# EAGLE design CyloRen-v.6.0 (EAGLE 9.1.0)
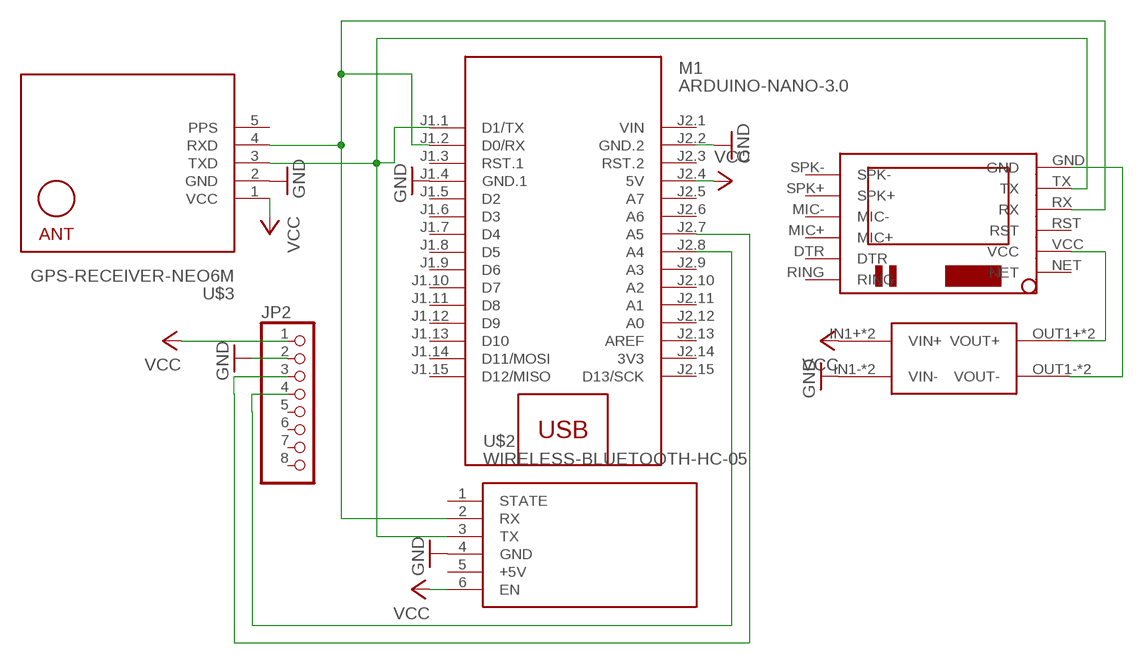
[diagram p0: schematic, sheet 1]

## Parts
JP2  PINHD-1X8BIG  [1X08-BIG]
M1  ARDUINO-NANO-3.0  [ARDUINO-NANO-3.0]
U$1  MP1584  [DC-BRICK]
U$2  WIRELESS-BLUETOOTH-HC-05  [WIRELESS-BLUETOOTH-HC-05]
U$3  GPS-RECEIVER-NEO6M  [GPS-RECEIVER-NEO6M]
U$4  SIM800LMODULE  [SIM800LMODULE]

## Nets
GND: JP2.2 M1.J1.4(GND.1) M1.J2.2(GND.2) U$1.IN1-(VIN-) U$1.IN2-(VIN-) U$2.4(GND) U$3.2(GND)
N$1: JP2.3 M1.J2.7(A5)
N$3: JP2.4 M1.J2.8(A4)
N$6: U$1.OUT1+(VOUT+) U$1.OUT2+(VOUT+) U$4.VCC
N$7: M1.J1.1(D1/TX) U$2.3(TX) U$3.3(TXD) U$4.TX
N$8: M1.J1.2(D0/RX) U$2.2(RX) U$3.4(RXD) U$4.RX
N$9: U$1.OUT1-(VOUT-) U$1.OUT2-(VOUT-) U$4.GND
VCC: JP2.1 M1.J2.4(5V) U$1.IN1+(VIN+) U$1.IN2+(VIN+) U$2.6(EN) U$3.1(VCC)
Unconnected: JP2.5 JP2.6 JP2.7 JP2.8 M1.J1.3(RST.1) M1.J1.5(D2) M1.J1.6(D3) M1.J1.7(D4) M1.J1.8(D5) M1.J1.9(D6) M1.J1.10(D7) M1.J1.11(D8) M1.J1.12(D9) M1.J1.13(D10) M1.J1.14(D11/MOSI) M1.J1.15(D12/MISO) M1.J2.3(RST.2) M1.J2.5(A7) M1.J2.6(A6) M1.J2.9(A3) M1.J2.10(A2) M1.J2.11(A1) M1.J2.12(A0) M1.J2.13(AREF) M1.J2.15(D13/SCK) U$2.1(STATE) U$4.DTR U$4.MIC+ U$4.MIC- U$4.NET U$4.RING U$4.RST U$4.SPK+ U$4.SPK-

## Power pins joined to a net without a drawn wire
3V3: M1.J2.14(3V3)
+5V: U$2.5(+5V)
PPS: U$3.5(PPS)
VIN: M1.J2.1(VIN)

## Library data of the parts
JP2 = adafruit:PINHD-1X8: PIN HEADER
M1 = diy-modules:ARDUINO-NANO-3.0: Arduino Nano 3.0 and compatible devices More details available here: https://www.arduino.cc/en/Main/ArduinoBoardNano Click here to find device on ebay.com <http://www.ebay.com/sch/arduino+nano>
U$1 = MP1584-dc-brick:MP1584: MP1584-dc-brick-pcb Step down Input: 4.5V - 28V Ouput 0.8V - 25V max. 3A Cheap on ebay
U$2 = diy-modules:WIRELESS-BLUETOOTH-HC-05: Bluetooth Transceiver Module based on HC-05 board Tutorial is available here: https://arduino-info.wikispaces.com/BlueTooth-HC05-HC06-Modules-How-To Click here to find device on ebay.com <http://www.ebay.com/sch/hc-05+module+rs232>
U$3 = diy-modules:GPS-RECEIVER-NEO6M: GPS Receiver Module based on NEO-6 device Short tutorial how to use NEO-6 module with Arduino: http://www.xarg.org/2016/06/neo6mv2-gps-module-with-arduino/ NEO-6 datasheet is available here: https://www.u-blox.com/sites/default/files/products/documents/NEO-6_DataSheet_%28GPS.G6-HW-09005%29.pdf Click here to find device on ebay.com <http://www.ebay.com/sch/gyneo6mv2>
U$4 = SIM800LMODULE:SIM800LMODULE: SIM800L Module

## Board
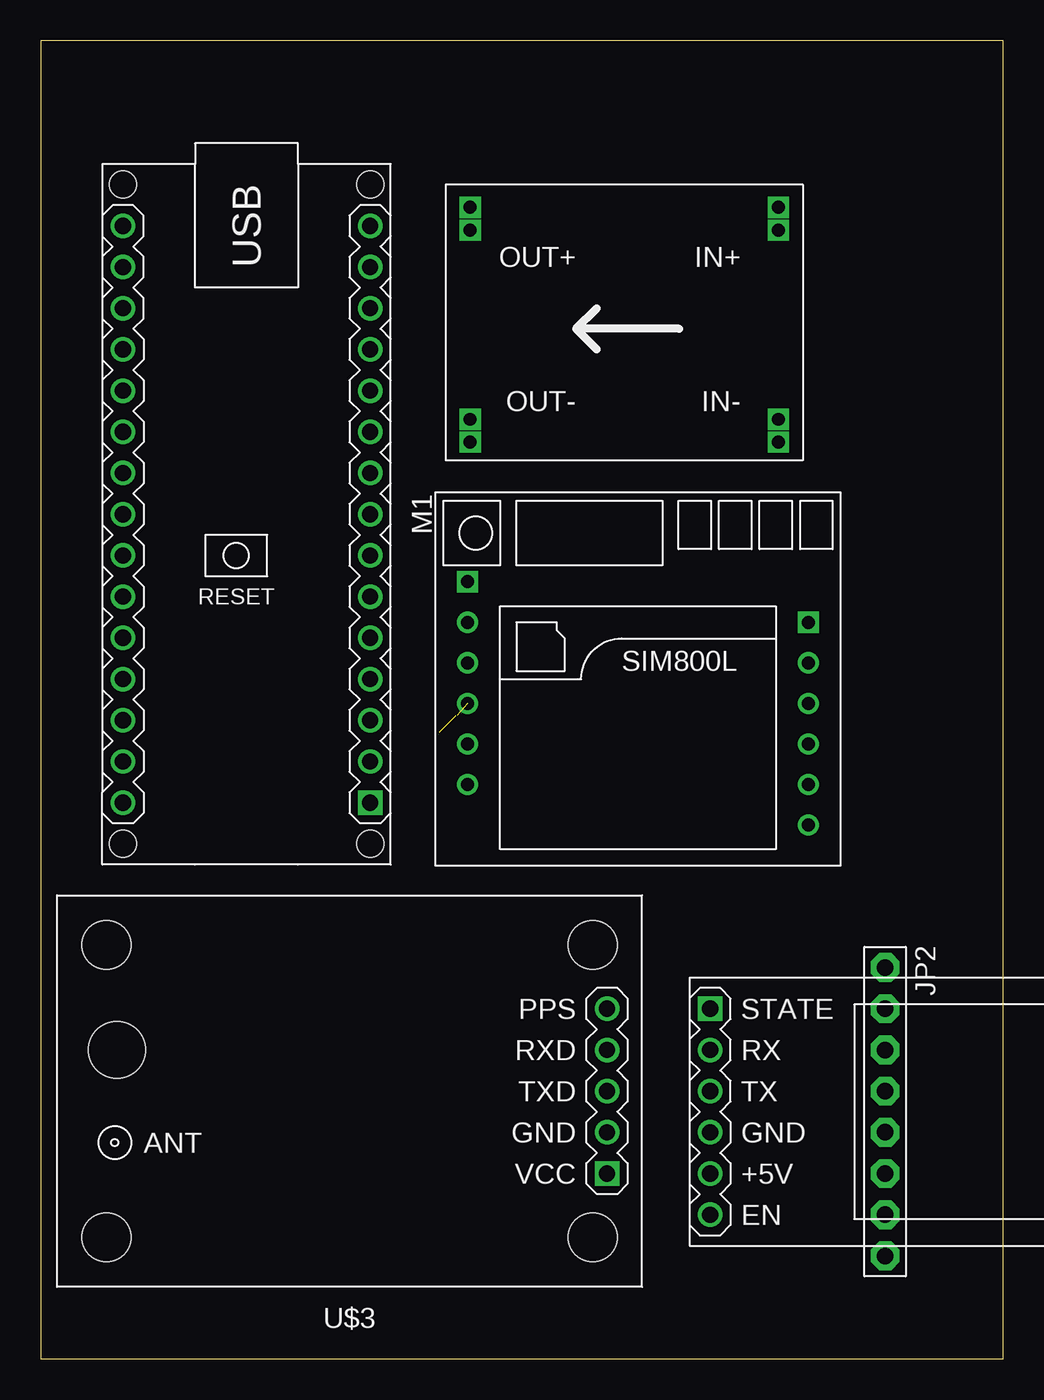
[diagram p1: board, top side]
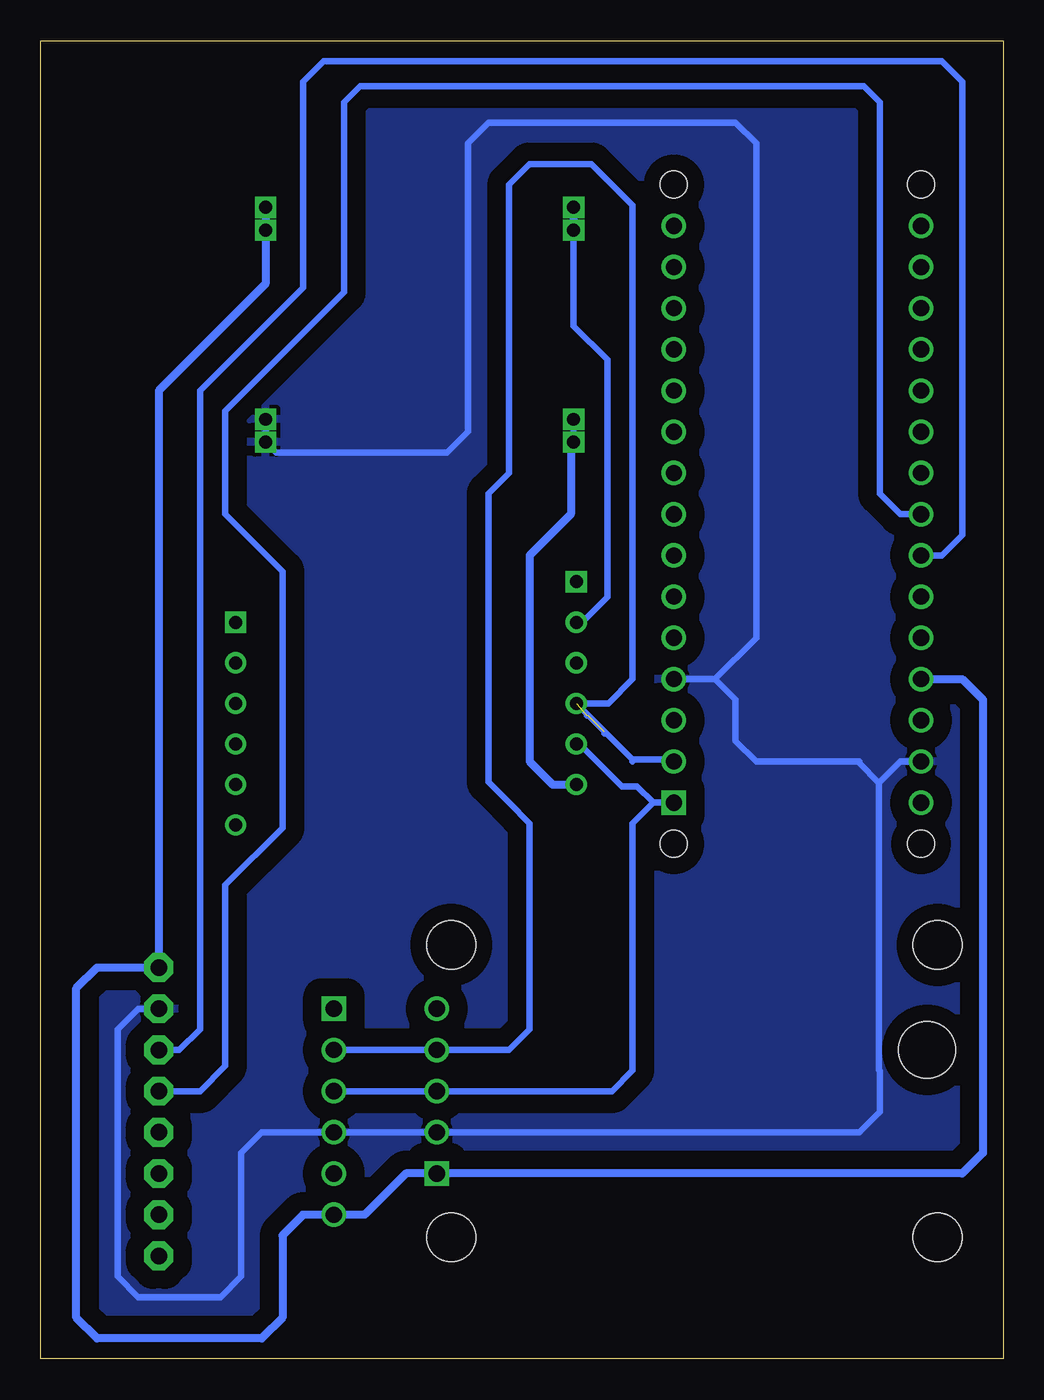
[diagram p2: board, bottom side, seen from below]

Size 59.36 x 81.27 mm. Coordinates in mm from the lower left corner, seen from the top.
Outline: 0,0 59.36,0 59.36,81.27 0,81.27 0,0
Copper layers (1*16): Top 0.035mm / dielectric 1.5mm / Bottom 0.035mm
Design rules "default *": minimum track width 6mil, minimum drill 0.35mm, track to track 45mil, track to pad 35mil, pad to pad 6mil, via to via 6mil, smd to smd 6mil, copper to edge 40mil, drill to drill 6mil, minimum pad ring 10mil, minimum via ring 8mil, stop-mask expansion 4mil, vias tented up to drill 0mil, thermal gap 10mil

### Footprints (pad centres in the part's own frame; a part is rotated, then mirrored left to right if it is on the bottom)
1X08-BIG = drill 1.016 pad 1.778 octagon: 1 -8.89,0; 2 -6.35,0; 3 -3.81,0; 4 -1.27,0; 5 1.27,0; 6 3.81,0; 7 6.35,0; 8 8.89,0
ARDUINO-NANO-3.0 = drill 1 square: J1.1 17.78,7.62 | drill 1: J1.2 15.24,7.62; J1.3 12.7,7.62; J1.4 10.16,7.62; J1.5 7.62,7.62; J1.6 5.08,7.62; J1.7 2.54,7.62; J1.8 0,7.62; J1.9 -2.54,7.62; J1.10 -5.08,7.62; J1.11 -7.62,7.62; J1.12 -10.16,7.62; J1.13 -12.7,7.62; J1.14 -15.24,7.62; J1.15 -17.78,7.62; J2.1 17.78,-7.62; J2.2 15.24,-7.62; J2.3 12.7,-7.62; J2.4 10.16,-7.62; J2.5 7.62,-7.62; J2.6 5.08,-7.62; J2.7 2.54,-7.62; J2.8 0,-7.62; J2.9 -2.54,-7.62; J2.10 -5.08,-7.62; J2.11 -7.62,-7.62; J2.12 -10.16,-7.62; J2.13 -12.7,-7.62; J2.14 -15.24,-7.62; J2.15 -17.78,-7.62 | hole 1.651: -20.32,7.62; -20.32,-7.62; 20.32,-7.62; 20.32,7.62
DC-BRICK = drill 0.8 square: IN1+ 1.5,1.4; IN1- 1.5,14.47; IN2+ 1.5,2.8; IN2- 1.5,15.87; OUT1+ 20.5,1.4; OUT1- 20.5,14.47; OUT2+ 20.5,2.8; OUT2- 20.5,15.87
WIRELESS-BLUETOOTH-HC-05 = drill 1 square: 1 -6.35,-17.145 | drill 1: 2 -3.81,-17.145; 3 -1.27,-17.145; 4 1.27,-17.145; 5 3.81,-17.145; 6 6.35,-17.145
GPS-RECEIVER-NEO6M = drill 1 square: 1 -15.875,5.08 | drill 1: 2 -15.875,2.54; 3 -15.875,0; 4 -15.875,-2.54; 5 -15.875,-5.08 | hole 3: -14.986,9.017; -14.986,-9.017; 14.986,-9.017; 14.986,9.017 | hole 3.5: 14.351,-2.54
SIM800LMODULE = drill 0.8: DTR 10.5,1; GND -10.5,-6.5; MIC+ 10.5,-1.5; MIC- 10.5,-4; RST -10.5,1; RX -10.5,-1.5; SPK+ 10.5,-6.5; SPK- 10.5,-9; TX -10.5,-4; VCC -10.5,3.5 | drill 0.8 square: NET -10.5,6; RING 10.5,3.5

### Placement (x,y rotation side)
JP2  52.07,15.24 270 top
M1  12.7,52.07 270 top
U$1  46.99,72.39 180 top
U$2  58.42,15.24 270 top
U$3  19.05,16.51 180 top
U$4  36.83,41.91 0 top

### Tracks (layer width: path | path; a pad name or v marks a point on that pad's centre or on a via)
GND
  Bottom 0.406: JP2.2 53.34,21.59 54.61,20.32 54.61,5.08 53.34,3.81 48.26,3.81 46.99,5.08 46.99,12.7 45.72,13.97 U$2.4 U$3.2 8.89,13.97 7.62,15.24 7.62,17.77 7.67,17.82 7.67,35.51 | 7.67,35.51 6.35,36.83 M1.J2.2 | U$1.IN1- U$1.IN2- 44.85,55.88 34.29,55.88 33.02,57.15 33.02,74.93 31.75,76.2 16.51,76.2 15.24,74.93 15.24,44.45 17.78,41.91 | 7.67,35.51 8.89,36.73 8.89,36.83 15.24,36.83 16.51,38.1 16.51,40.64 17.78,41.91 | 17.78,41.91 M1.J1.4
  pour Bottom: 0,81.28 59.69,81.28 59.69,0 0,0
  pour Bottom: 0,81.28 59.69,81.28 59.69,0 0,0
  pour Bottom: 0,81.28 59.69,81.28 59.69,0 0,0
N$1
  Bottom 0.406: JP2.3 50.8,19.05 49.53,20.32 49.53,59.69 43.18,66.04 43.18,78.74 41.91,80.01 3.81,80.01 2.54,78.74 2.54,50.8 3.81,49.53 M1.J2.7
N$3
  Bottom 0.406: 47.98,58.42 | 47.98,58.42 | 40.64,65.76 | M1.J2.8 6.35,52.07 7.62,53.34 7.62,77.47 8.61,78.46 39.65,78.46 40.64,77.47 40.64,65.76 | 40.64,65.76 47.98,58.42 | 47.98,58.42 47.98,54.61 | 47.98,54.61 | 47.98,54.61 47.98,52.07 | 47.98,52.07 | 47.98,52.07 44.45,48.54 44.45,32.74 47.98,29.21 47.98,18.06 49.53,16.51 JP2.4
N$6
  Bottom 0.406: U$1.OUT2+ 26.49,63.68 24.41,61.6 24.41,46.98 25.98,45.41 U$4.VCC
  Bottom 0.508: U$1.OUT1+ U$1.OUT2+
N$7
  Bottom 0.406: U$2.3 35.56,16.51 | 35.56,16.51 U$3.3 | M1.J1.1 21.59,34.29 | 21.59,34.29 22.86,33.02 22.86,17.78 24.13,16.51 | 24.13,16.51 | 24.13,16.51 35.56,16.51 | 26.13,37.91 U$4.TX 26.13,37.91 | 21.59,34.29 22.58,35.28 23.5,35.28 26.13,37.91
N$8  (2 unrouted)
  Bottom 0.406: 22.86,36.83 | U$2.2 U$3.4 30.48,19.05 29.21,20.32 | 22.86,36.83 | 22.86,36.83 | 22.86,36.83 | 24.58,38.55 24.58,38.63 | 25.61,39.66 25.69,39.66 | 22.86,36.94 U$4.RX 24.36,40.41 22.86,41.91 22.86,71.12 25.4,73.66 29.21,73.66 30.48,72.39 30.48,71.12 | 22.86,36.94 22.86,36.83 | M1.J1.2 20.43,36.94 22.86,36.94 | 29.21,20.32 | 29.21,20.32 | 29.21,20.32 | 29.21,20.32 29.21,33.02 30.48,34.29 31.75,35.56 31.75,53.34 30.48,54.61 30.48,71.12 | 30.48,71.12
N$9
  Bottom 0.406: U$1.OUT1- U$1.OUT2-
  Bottom 0.508: U$1.OUT2- 26.67,56.34 26.67,52.07 29.21,49.53 29.21,36.83 27.79,35.41 U$4.GND
VCC
  Bottom 0.508: M1.J2.4 2.54,41.91 1.27,40.64 1.27,12.7 2.54,11.43 U$3.1 36.83,11.43 39.37,8.89 U$2.6 43.18,8.89 44.45,7.62 44.45,2.54 45.72,1.27 55.88,1.27 57.15,2.54 57.15,22.86 55.88,24.13 JP2.1 52.07,59.69 50.8,60.96 45.49,66.27 U$1.IN2+ U$1.IN1+